# EAGLE design wall-ink (EAGLE 9.0.1)
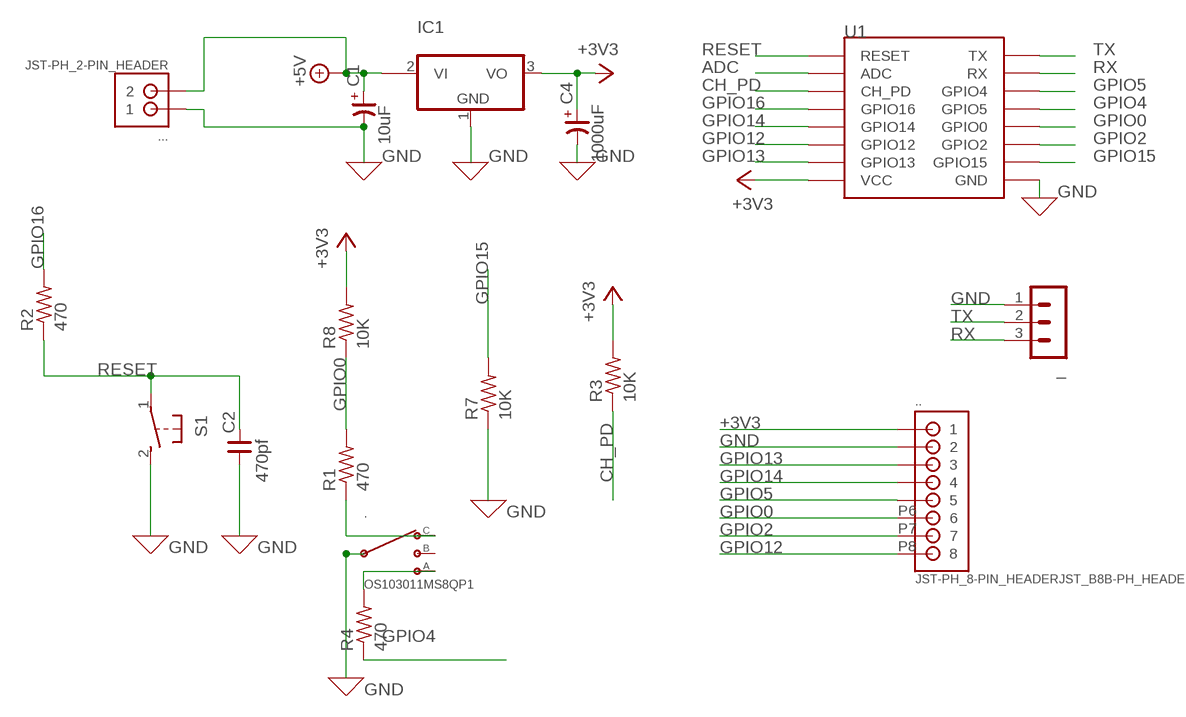
[diagram p0: schematic, sheet 1]

## Parts
.  OS103011MS8QP1  [OS102011MS8QP1]
..  JST-PH_8-PIN_HEADERJST_B8B-PH_HEADER  [JST_B5B-PH_HEADER]
...  JST-PH_2-PIN_HEADER  [JST_B2B-PH_HEADER]
_  MA03-1  [MA03-1]
C1  10uF  CP-E-020X050  [E-020X050]
C2  470pf  CNP-C025-040X018  [C025-040X018]
C4  1000uF  CP-E-050X100  [E-050X100]
IC1  MCP170312MB  [SOT89]
R1  470  R-US_0204/5  [0204/5]
R2  470  R-US_0204/5  [0204/5]
R3  10K  R-US_0204/5  [0204/5]
R4  470  R-US_0204/5  [0204/5]
R7  10K  R-US_0204/5  [0204/5]
R8  10K  R-US_0204/5  [0204/5]
S1  31-XX  [B3F-31XX]
U1  ESP12SMD  [ESP12-SMD]

## Nets
+3V3: ...P1 C4.+ IC1.3(VO) R3.2 R8.2 U1.VCC
+5V: ....P2 C1.+ IC1.2@1(VI1)
ADC: U1.ADC
CH_PD: R3.1 U1.CH_PD
GND: ..2(C) ....P1 ...P2 _.1 C1.- C2.1 C4.- IC1.1(GND) R7.1 S1.2(S) U1.GND
GPIO0: ...P6 R1.2 R8.1 U1.GPIO0
GPIO2: ...P7 U1.GPIO2
GPIO4: R4.1 U1.GPIO5
GPIO5: ...P5 U1.GPIO4
GPIO12: ...P8 U1.GPIO12
GPIO13: ...P3 U1.GPIO13
GPIO14: ...P4 U1.GPIO14
GPIO15: R7.2 U1.GPIO15
GPIO16: R2.2 U1.GPIO16
N$1: ..4 R1.1
N$8: ..1 R4.2
RESET: C2.2 R2.1 S1.1(P) U1.RESET
RX: _.3 U1.RXD0(RX)
TX: _.2 U1.TXD0(TX)
Unconnected: ..3 IC1.2(VI)

## Library data of the parts
. = switches:OS103011MS8QP1: Slide Switch SP3T Through Hole; DIGIKEY: CKN9543-ND
.. = SRG-jst8-added:JST-PH_8-PIN_HEADER: 8-pin JST PH Shrouded Header, top entry P/N B8B-PH-K-S Mating connector PHR-8
... = SRG-jst8-added:JST-PH_2-PIN_HEADER: 2-pin JST PH Shrouded Header, top entry P/N B2B-PH-K-S Mating connector PHR-2 Mating cable assembly: Sparkfun PRT-09914 <http://www.sparkfun.com/products/9914>
_ = con-lstb:MA03-1: PIN HEADER; OC_FARNELL: unknown; OC_NEWARK: unknown
C1 C4 = cap-master:CP-: POLARIZED CAP
C2 = cap-master:CNP-: NON-POLARIZED CAP
IC1 = linear:MCP1703*: 250 mA, 16V, Low Quiescent Current LDO Regulator Source: http://ww1.microchip.com/downloads/en/DeviceDoc/22049b.pdf
R1-R4 R7 R8 = resistor-bigpad:R-US_: RESISTOR, American symbol
S1 = switch-omron:31-XX: OMRON SWITCH; MPN: B3F-3100; OC_FARNELL: 959704; OC_NEWARK: 36M3582
U1 = esp8266modules:ESP12: ESP8266 Wifi module 12

## Board
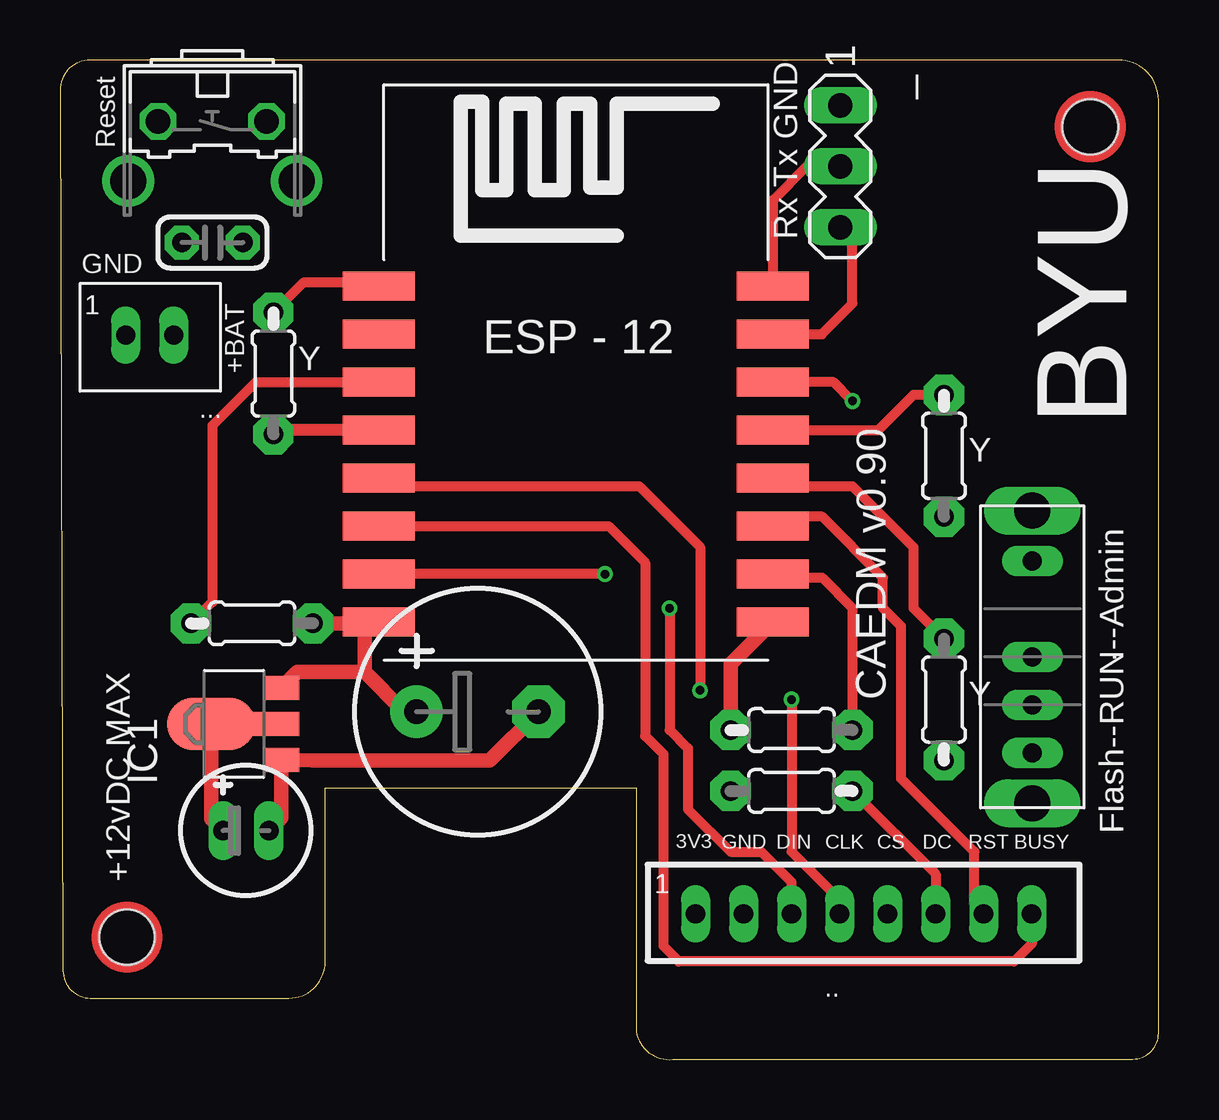
[diagram p1: board, top side]
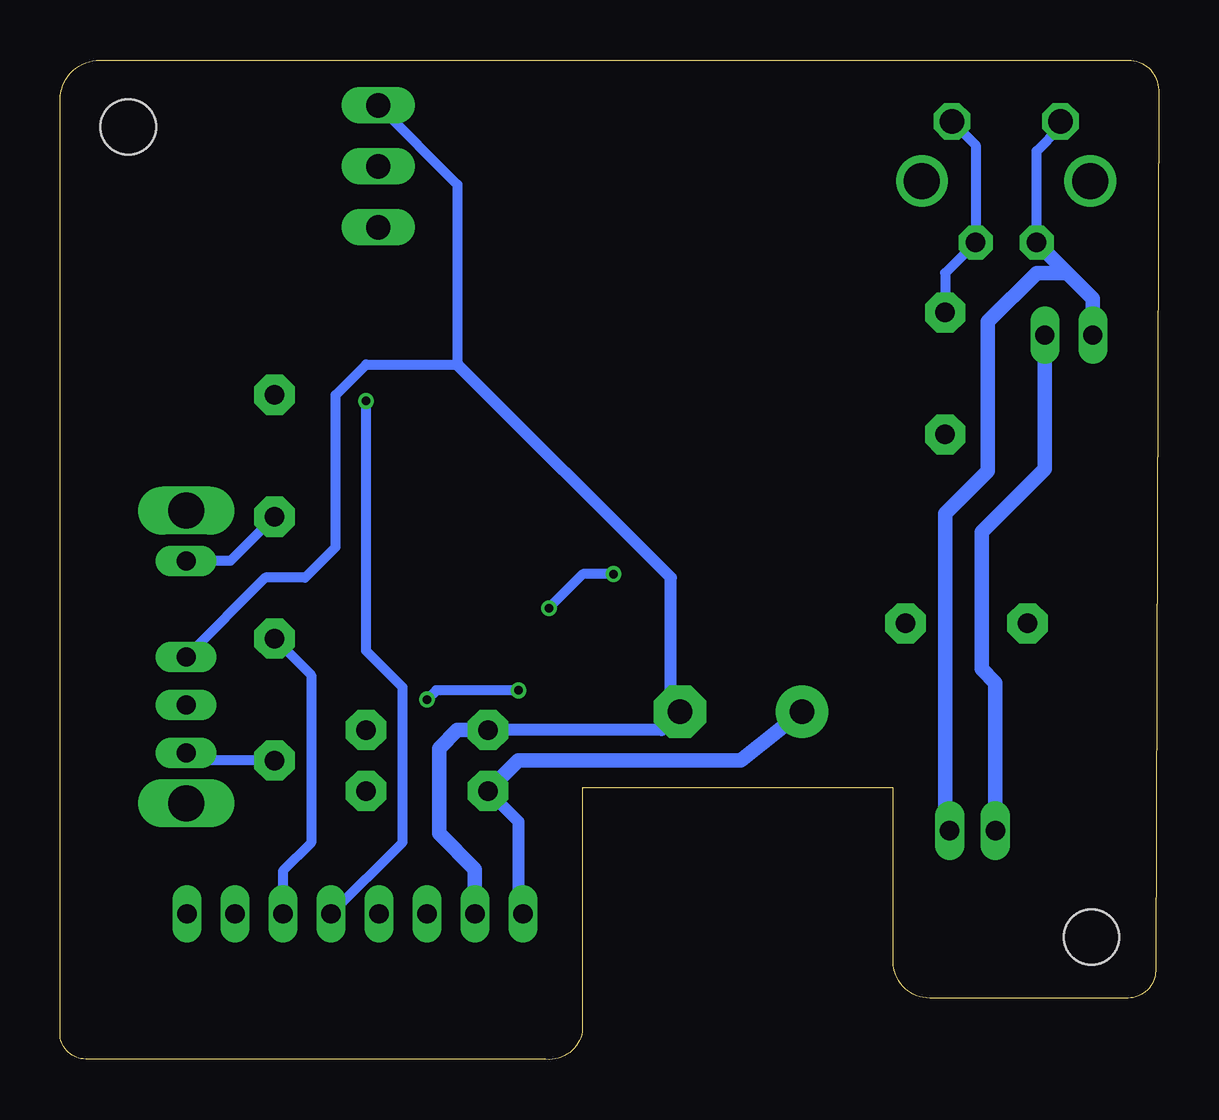
[diagram p2: board, bottom side, seen from below]

Size 45.77 x 41.67 mm. Coordinates in mm from the lower left corner, seen from the top.
Outline: 44.1,41.67 1.26,41.67 arc90 0,40.41 0.12,3.71 arc90 1.27,2.56 9.54,2.56 arc90 11.05,4.07 11.05,11.33 24,11.33 24,1.17 arc90 25.65,0.02 44.7,0.02 arc90 45.77,1.09 45.77,40 arc90 44.1,41.67
Copper layers (1*16): Top 0.035mm / dielectric 1.6mm / Bottom 0.035mm
Design rules "Elecrow_2-layer_PCB_eagle_rule *": minimum track width 6mil, minimum drill 12mil, track to track 6mil, track to pad 6mil, pad to pad 6mil, via to via 8mil, smd to smd 0mil, copper to edge 20mil, drill to drill 10mil, minimum pad ring 6mil, minimum via ring 6mil, stop-mask expansion 0mil, vias tented up to drill 100mil, thermal gap 10mil
Holes 2.3 mm at 2.79,5.1 42.93,38.88

### Footprints (pad centres in the part's own frame; a part is rotated, then mirrored left to right if it is on the bottom)
OS102011MS8QP1 = drill 0.8 pad 1.27 long: 1 -4,0; 2 0,0; 3 2,0; 4 4,0 | drill 1.5 pad 1.778 long: MOUNT1 -6.1,0; MOUNT2 6.1,0
JST_B5B-PH_HEADER = drill 0.8 long: P1 4,0.048; P2 2,0.048; P3 0,0.048; P4 -2,0.048; P5 -4,0.048; P6 -6,0.048; P7 -8,0.048; P8 -10,0.048
JST_B2B-PH_HEADER = drill 0.8 long: P1 1.075,0.048; P2 -0.925,0.048
MA03-1 = drill 1.016 long: 1 -2.54,0; 2 0,0; 3 2.54,0
E-020X050 = drill 0.813 long: + -0.953,0; - 0.953,0
C025-040X018 = drill 0.813 pad 1.422 octagon: 1 -1.27,0; 2 1.27,0
E-050X100 = drill 1.016 pad 2.184: + -2.54,0 | drill 1.016 pad 2.184 octagon: - 2.54,0
SOT89 = smd 1 x 1.5: 1 -1.499,-1.981; 3 1.499,-1.981 | smd 1 x 2: 2 0,-1.727 | smd 2.2 x 3.7: 2@1 0,0.94
0204/5 = drill 0.813 pad 1.676 octagon: 1 -2.54,0; 2 2.54,0
B3F-31XX = drill 1.016 octagon: 1 -2.261,-1.245; 2 2.261,-1.245 | drill 1.499 pad 2.159: 3 -3.505,1.245; 4 3.505,1.245
ESP12-SMD = smd 3 x 1.2: ADC -8.3,3.8; CH_PD -8.3,1.8; GND 8.1,-8.2; GPIO0 8.1,-2.2; GPIO2 8.1,-4.2; GPIO4 8.1,1.8; GPIO5 8.1,-0.2; GPIO12 -8.3,-4.2; GPIO13 -8.3,-6.2; GPIO14 -8.3,-2.2; GPIO15 8.1,-6.2; GPIO16 -8.3,-0.2; RESET -8.3,5.8; RXD0 8.1,3.8; TXD0 8.1,5.8; VCC -8.3,-8.2

### Placement (x,y rotation side)
.  40.51,16.79 270 top
..  30.48,6.12 180 top
...  3.81,30.25 180 top
_  32.51,37.23 270 top
C1  7.75,9.55 0 top
C2  6.35,34.06 0 top
C4  17.4,14.5 0 top
IC1  7.24,13.99 90 top
R1  36.83,15.01 90 top
R2  8.89,28.6 270 top
R3  8,18.18 0 top
R4  36.83,25.17 270 top
R7  30.48,13.74 0 top
R8  30.48,11.2 180 top
S1  6.35,37.87 180 top
U1  21.59,26.44 0 top

### Tracks (layer width: path | path; a pad name or v marks a point on that pad's centre or on a via)
+3V3
  Top 0.406: U1.VCC 13.41,18.12 12.7,18.12
  Top 0.61: R3.2 12.7,18.18 | 12.7,18.18 13.34,18.18 13.41,18.12 | 12.7,16.15 12.7,18.18 | 12.7,16.15 14.35,14.5 C4.+ | IC1.3 9.88,16.15 12.7,16.15
  Bottom 0.406: 26.6,6.19 ...P1
  Bottom 0.508: R8.2 26.67,9.93 26.67,6.12 26.6,6.19
  Bottom 0.61: 27.69,11.45 R8.2 26.67,12.47 17.4,12.47 C4.+
+5V
  Top 0.61: C1.+ 6.3,10.04 IC1.2@1
  Bottom 0.61: C1.+ 6.79,15.71 7.37,16.28 7.37,21.99 4.73,24.62 ....P2
CH_PD
  Top 0.406: U1.CH_PD 8.15,28.24 6.35,26.44 6.35,19.07 R3.1
GND
  Top 0.61: R7.1 27.94,16.49 U1.GND | C4.- 17.91,12.47 10.52,12.47 IC1.1 9.22,10.07 C1.-
  Bottom 0.406: 4.12,39.14 S1.2 4.09,38.86 5.08,37.87 C2.1 5.08,33.74 | ..2 37.21,20.09 35.56,20.09 34.29,21.36 34.29,27.71 33.02,28.98 29.21,28.98 29.21,36.47 _.1
  Bottom 0.508: R7.1 20.7,13.74 C4.- 20.32,14.88 20.32,20.09 29.21,28.98
  Bottom 0.61: 27.69,13.48 R7.1 29.21,13.74 29.97,12.98 29.97,9.42 28.48,7.93 ...P2 | ....P1 2.73,31.71 3.81,32.79 | 3.81,32.79 5.08,32.79 7.11,30.76 7.11,24.53 8.89,22.76 8.89,9.74 C1.- | 3.81,32.79 C2.1
GPIO0
  Top 0.406: U1.GPIO0 30.03,23.9 33.02,23.9 35.56,21.36 35.56,18.82 R1.2 | R8.1 36.48,7.74 ...P6
  Bottom 0.406: R1.2 35.31,16.02 35.31,9.04 36.48,7.87 ...P6
GPIO2
  Top 0.406: U1.GPIO2 30.09,22.24 30.48,22.63 31.75,22.63 34.29,20.09 34.29,18.82 35.05,18.06 35.05,11.71 38.1,8.66 38.1,6.45 ...P7
GPIO4
  Top 0.406: 29.89,26.44 U1.GPIO5 34.09,26.24 35.56,27.71 R4.1
GPIO5  (via drill 0.35)
  Top 0.406: v33.02,27.45 32.23,28.24 U1.GPIO4
  Bottom 0.406: ...P5 31.5,9.05 31.5,15.52 33.02,17.04 v33.02,27.45
GPIO12
  Top 0.406: 12.7,22.24 U1.GPIO12 22.86,22.24 24.38,20.71 24.38,13.48 25.15,12.72 25.15,4.72 25.78,4.09 39.75,4.09 40.48,4.82 ...P8 | 12.7,22.24 12.31,22.24 | 12.7,22.63 12.31,22.63 12.7,22.24
GPIO13  (via drill 0.35)
  Top 0.406: U1.GPIO13 13.29,20.09 | U1.GPIO13 13.14,20.09 | ...P3 30.48,7.39 29.21,8.66 27.94,8.66 26.16,10.44 26.16,12.98 25.4,13.74 v25.4,18.82 | 13.44,20.09 U1.GPIO13 | v22.71,20.24 U1.GPIO13
  Bottom 0.406: v22.71,20.24 23.98,20.24 v25.4,18.82
GPIO14  (via drill 0.35)
  Top 0.406: 13.29,23.9 U1.GPIO14 13.63,24.24 13.97,23.9 24.13,23.9 26.67,21.36 v26.67,15.39 | ...P4 32.48,6.66 30.48,8.66 v30.48,15.01
  Bottom 0.406: v26.67,15.39 30.1,15.39 v30.48,15.01
GPIO15
  Top 0.406: U1.GPIO15 29.84,20.09 31.75,20.09 33.02,18.82 R7.2
GPIO16
  Top 0.406: 13.29,26.44 U1.GPIO16 13.09,26.44
  Top 0.508: U1.GPIO16 9.07,26.24 R2.2
N$1
  Bottom 0.406: R1.1 40.2,12.47 ..4
N$8
  Bottom 0.406: R4.2 38.67,20.79 ..1
RESET
  Top 0.406: R2.1 10.16,32.41 13.12,32.41
  Top 0.508: 13.12,32.41 U1.RESET
  Bottom 0.406: S1.1 7.62,38.12 C2.2 8.89,32.79 R2.1
RX
  Top 0.406: U1.RXD0 31.74,30.24 33.02,31.52 33.02,34.19 _.3
TX
  Top 0.406: U1.TXD0 29.69,35.81 31.11,37.23 _.2 32.39,37.23
(copper drawn outside any net)
  shapes: Top circle x2

### Text on the board
tPlace: Reset | Rx Tx GND | GND | +BAT | Y | BYU | Y | +12vDC MAX | CAEDM v0.90 | Y | 3V3 | GND | DIN | CLK | CS | DC | RST | BUSY | Flash--RUN--Admin